# Altium schematic sheet DriverCircuit_1.0.0.SchDoc
size Letter
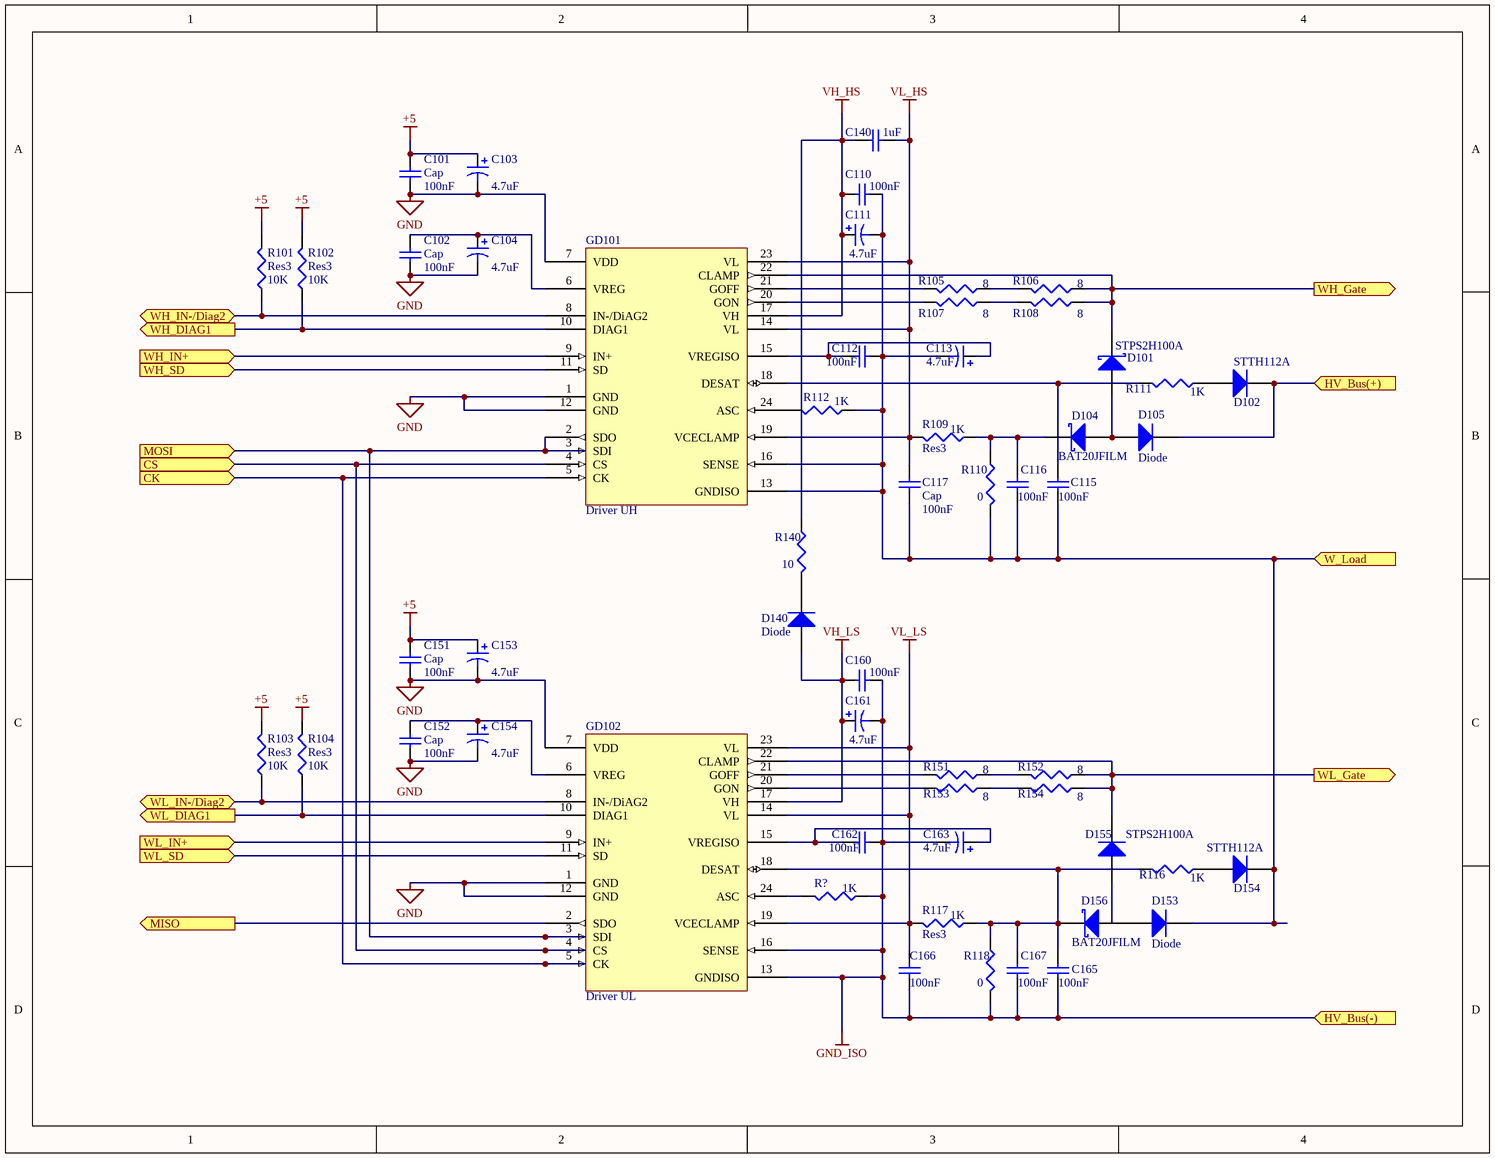
[diagram p0: DriverCircuit_1.0.0.SchDoc]

## Parts
C101  Cap  value 100nF  [C1206]
C102  Cap  value 100nF  [C1206]
C103  value 4.7uF  [1812]
C104  value 4.7uF  [1812]
C110  value 100nF  [C1206]  (hidden comment: Cap)
C111  value 4.7uF  [1812]
C112  value 100nF  [C1206]  (hidden comment: Cap)
C113  value 4.7uF  [1812]
C115  value 100nF  [C1206]  (hidden comment: Cap)
C116  value 100nF  [C1206]  (hidden comment: Cap)
C117  Cap  value 100nF  [C1206]
C140  value 1uF  [C1206]  (hidden comment: Cap)
C151  Cap  value 100nF  [C1206]
C152  Cap  value 100nF  [C1206]
C153  value 4.7uF  [1812]
C154  value 4.7uF  [1812]
C160  value 100nF  [C1206]  (hidden comment: Cap)
C161  value 4.7uF  [1812]
C162  value 100nF  [C1206]  (hidden comment: Cap)
C163  value 4.7uF  [1812]
C165  value 100nF  [C1206]  (hidden comment: Cap)
C166  value 100nF  [C1206]
C167  value 100nF  [C1206]  (hidden comment: Cap)
D101  STPS2H100A  [SMB]
D102  STTH112A  [SMC]
D104  BAT20JFILM  [SMB]
D105  Diode  [SMC]
D140  Diode  [SMC]
D153  Diode  [SMC]
D154  STTH112A  [SMC]
D155  STPS2H100A  [SMC]
D156  BAT20JFILM  [SMB]
GD101  Driver UH  [SO24W]
GD102  Driver UL  [SO24W]
R101  Res3  value 10K  [J1-0603]
R102  Res3  value 10K  [J1-0603]
R103  Res3  value 10K  [J1-0603]
R104  Res3  value 10K  [J1-0603]
R105  value 8  [J1-0603]  (hidden comment: Res3)
R106  value 8  [J1-0603]  (hidden comment: Res3)
R107  value 8  [J1-0603]  (hidden comment: Res3)
R108  value 8  [J1-0603]  (hidden comment: Res3)
R109  Res3  value 1K  [J1-0603]
R110  value 0  [J1-0603]  (hidden comment: Res3)
R111  value 1K  [J1-0603]  (hidden comment: Res3)
R112  value 1K  [J1-0603]
R116  value 1K  [J1-0603]  (hidden comment: Res3)
R117  Res3  value 1K  [J1-0603]
R118  value 0  [J1-0603]  (hidden comment: Res3)
R140  value 10  [J1-0603]  (hidden comment: Res3)
R151  value 8  [J1-0603]  (hidden comment: Res3)
R152  value 8  [J1-0603]  (hidden comment: Res3)
R153  value 8  [J1-0603]  (hidden comment: Res3)
R154  value 8  [J1-0603]  (hidden comment: Res3)
R?  value 1K  [J1-0603]

## Ports
CK (in), CS (in), HV_Bus(+) (in), HV_Bus(-) (in), MISO (out), MOSI (in), W_Load (in), WH_DIAG1 (out), WH_Gate (out), WH_IN+ (in), WH_IN-/Diag2 (bidir), WH_SD (in), WL_DIAG1 (out), WL_Gate (out), WL_IN+ (in), WL_IN-/Diag2 (bidir), WL_SD (in)

## Nets
+5: C101.2 C103.1 C151.2 C153.1 R101.2 R102.2 R103.2 R104.2
GND: C101.1 C102.1 C103.2 C104.2 C151.1 C152.1 C153.2 C154.2 GD101.1(GND) GD101.7(VDD) GD101.12(GND) GD102.1(GND) GD102.7(VDD) GD102.12(GND)
GND_ISO: C160.2 C161.2 C162.2 C163.2 C165.1 C166.1 C167.1 GD102.13(GNDISO) GD102.16(SENSE) R118.2 R?.1 ; port HV_Bus(-)
VH_HS: C110.1 C111.1 C140.1 GD101.17(VH) R140.1
VH_LS: C160.1 C161.1 D140.1(A) GD102.17(VH)
VL_HS: C117.2 C140.2 GD101.14(VL) GD101.19(VCECLAMP) GD101.23(VL) R109.2
VL_LS: C166.2 GD102.14(VL) GD102.19(VCECLAMP) GD102.23(VL) R117.2
CK: GD101.5(CK) GD102.5(CK) ; port CK
CS: GD101.4(CS) GD102.4(CS) ; port CS
HV_Bus(+): D102.2(K) D105.2(K) ; port HV_Bus(+)
MISO: GD102.2(SDO) ; port MISO
MOSI: GD101.2(SDO) GD101.3(SDI) GD102.3(SDI) ; port MOSI
W_Load: C110.2 C111.2 C112.2 C113.2 C115.1 C116.1 C117.1 D153.2(K) D154.2(K) GD101.13(GNDISO) GD101.16(SENSE) R110.2 R112.1 ; port W_Load
WH_DIAG1: GD101.10(DIAG1) R102.1 ; port WH_DIAG1
WH_Gate: D101.2(K) GD101.22(CLAMP) R106.1 R108.1 ; port WH_Gate
WH_IN+: GD101.9(IN+) ; port WH_IN+
WH_IN-/Diag2: GD101.8(IN-/DiAG2) R101.1 ; port WH_IN-/Diag2
WH_SD: GD101.11(SD) ; port WH_SD
WL_DIAG1: GD102.10(DIAG1) R104.1 ; port WL_DIAG1
WL_Gate: D155.2(K) GD102.22(CLAMP) R152.1 R154.1 ; port WL_Gate
WL_IN+: GD102.9(IN+) ; port WL_IN+
WL_IN-/Diag2: GD102.8(IN-/DiAG2) R103.1 ; port WL_IN-/Diag2
WL_SD: GD102.11(SD) ; port WL_SD
NetC102_2: C102.2 C104.1 GD101.6(VREG)
NetC112_1: C112.1 C113.1 GD101.15(VREGISO)
NetC115_2: C115.2 GD101.18(DESAT) R111.2
NetC116_2: C116.2 D104.2(K) R109.1 R110.1
NetC152_2: C152.2 C154.1 GD102.6(VREG)
NetC162_1: C162.1 C163.1 GD102.15(VREGISO)
NetC165_2: C165.2 C167.2 D156.2(K) GD102.18(DESAT) R116.2 R117.1 R118.1
NetD101_1: D101.1(A) D104.1(A) D105.1(A)
NetD102_1: D102.1(A) R111.1
NetD140_2: D140.2(K) R140.2
NetD153_1: D153.1(A) D156.1(A)
NetD154_1: D154.1(A) R116.1
NetGD101_20: GD101.20(GON) R107.2
NetGD101_21: GD101.21(GOFF) R105.2
NetGD101_24: GD101.24(ASC) R112.2
NetGD102_20: GD102.20(GON) R153.2
NetGD102_21: GD102.21(GOFF) R151.2
NetGD102_24: GD102.24(ASC) R?.2
NetR105_1: R105.1 R106.2
NetR107_1: R107.1 R108.2
NetR151_1: R151.1 R152.2
NetR153_1: R153.1 R154.2

Not connected (* = marked no-connect by the designer): D155 1(A)

## Library data of the parts
C101 C102 C110 C112 C115-C117 C151 C152 C160 C162 C165-C167 = Cap Semi: Capacitor (Semiconductor SIM Model); Published: 8-Jun-2000; LatestRevisionDate: 29-May-2009; LatestRevisionNote: IPC-7351 Footprint Added.; PackageReference: C1206; Publisher: Altium Limited; PackageDescription: Chip Capacitor
C103 C104 C111 C113 C153 C154 C161 C163 = Cap Pol3: Polarized Capacitor (Surface Mount); Published: 8-Jun-2000; LatestRevisionDate: 29-May-2009; LatestRevisionNote: IPC-7351 Footprint Added.; PackageReference: C0805; Publisher: Altium Limited; PackageDescription: Chip Capacitor
C140 = Cap Semi: CBoot; Published: 8-Jun-2000; LatestRevisionDate: 29-May-2009; LatestRevisionNote: IPC-7351 Footprint Added.; PackageReference: C1206; Publisher: Altium Limited; PackageDescription: Chip Capacitor
D101 D104 D156 = D Schottky: Schottky Diode; Published: 8-Jun-2000; LatestRevisionDate: 17-Jul-2002; LatestRevisionNote: Re-released for DXP Platform.; PackageReference: SMB; Publisher: Altium Limited; PackageDescription: DO-214-AA/SMB; 2 C-Bend Leads; Body 5.3 x 3.6 mm, inc. leads (LxW); Code_JEDEC: DO-214-AA
D102 D105 D153-D155 = Diode: Default Diode; Published: 8-Jun-2000; LatestRevisionDate: 17-Jul-2002; LatestRevisionNote: Re-released for DXP Platform.; PackageVersion: Sep-1996; PackageReference: SMC; Publisher: Altium Limited; PackageDescription: DO-214-AB/SMC; 2 C-Bend Leads; Body 7.9 x 5.9 mm, inc. leads (LxW); Code_JEDEC: DO-214-AB
D140 = Diode: DBoot; Published: 8-Jun-2000; LatestRevisionDate: 17-Jul-2002; LatestRevisionNote: Re-released for DXP Platform.; PackageVersion: Sep-1996; PackageReference: SMC; Publisher: Altium Limited; PackageDescription: DO-214-AB/SMC; 2 C-Bend Leads; Body 7.9 x 5.9 mm, inc. leads (LxW); Code_JEDEC: DO-214-AB
GD101 GD102 = Component_1
R101-R112 R116-R118 R151-R154 R? = Res3: Resistor; Published: 8-Jun-2000; LatestRevisionDate: 29-May-2009; LatestRevisionNote: IPC-7351 Footprint Added.; PackageReference: J1-0603; Publisher: Altium Limited; PackageDescription: Chip Resistor
R140 = Res3: RBoot; Published: 8-Jun-2000; LatestRevisionDate: 29-May-2009; LatestRevisionNote: IPC-7351 Footprint Added.; PackageReference: J1-0603; Publisher: Altium Limited; PackageDescription: Chip Resistor